# Altium project External_Board.PrjPcb
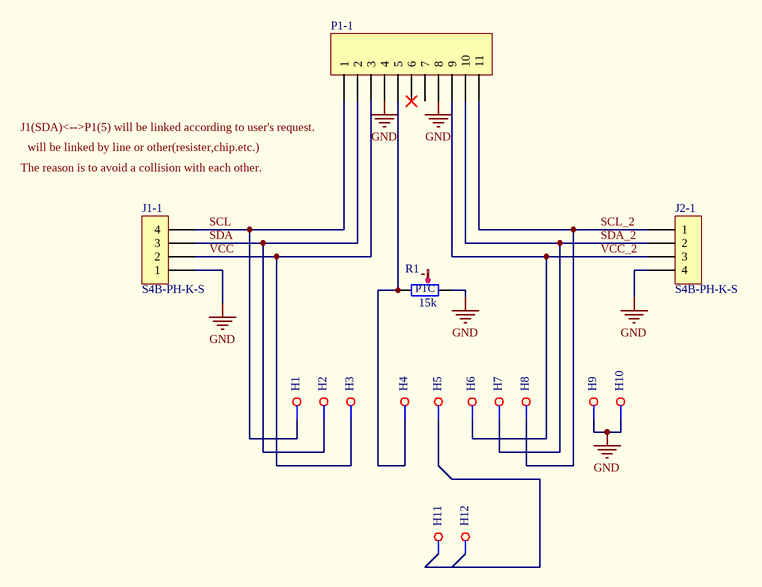
[diagram p0: External_Board_1mode.SchDoc]
3 sheets, 51 parts. Net scope: global (net labels, ports and power ports of the same name join across sheets).
Board files: External_Board_1 mode.PcbDoc, External_Board_2 mode.PcbDoc, External_Board_3 mode.PcbDoc
Sheets:
  External_Board_1mode.SchDoc
  External_Board_2mode.SchDoc
  External_Board_3mode.SchDoc

## Sheet External_Board_1mode.SchDoc: External Board Mode 1 - Resister Sense
size A4; DrawnBy: Anne Moller; Organization: Altium Limited; Address1: L3, 12a Rodborough Rd; Address2: Frenchs Forest; Address3: NSW; Address4: Australia 2086; Revision: 1.0.0; SheetNumber: 1; SheetTotal: 1

### Parts
(Parts that share a designator on the sheet are numbered #1, #2 ... from top to bottom, then left to right.)
H1#1  TP_HOLE  [TestHole]  (value not drawn)
H2#1  TP_HOLE  [TestHole]  (value not drawn)
H3#1  TP_HOLE  [TestHole]  (value not drawn)
H4#1  TP_HOLE  [TestHole]  (value not drawn)
H5#1  TP_HOLE  [TestHole]  (value not drawn)
H6#1  TP_HOLE  [TestHole]  (value not drawn)
H7#1  TP_HOLE  [TestHole]  (value not drawn)
H8#1  TP_HOLE  [TestHole]  (value not drawn)
H9#1  TP_HOLE  [TestHole]  (value not drawn)
H10#1  TP_HOLE  [TestHole]  (value not drawn)
H11#1  TP_HOLE  [TestHole]  (value not drawn)
H12#1  TP_HOLE  [TestHole]  (value not drawn)
J1-1  S4B-PH-K-S  [CON4]
J2-1  S4B-PH-K-S  [CON4]
P1-1  Header11  [CON11]  (value not drawn)
R1  Resistance in Ohms @ 25°C: 15k  [PTFT1206L1501JV]  (hidden comment: PTFT1206L1501JV)

### Nets
GND: H9#1.1(TP) H10#1.1(TP) J1-1.1 J2-1.4 P1-1.4 P1-1.8 R1.1
SCL: H1#1.1(TP) J1-1.4 P1-1.1
SCL_2: H8#1.1(TP) J2-1.1 P1-1.11
SDA: H2#1.1(TP) J1-1.3 P1-1.2
SDA_2: H7#1.1(TP) J2-1.2 P1-1.10
VCC: H3#1.1(TP) J1-1.2 P1-1.3
VCC_2: H6#1.1(TP) J2-1.3 P1-1.9
NetH4#1_1: H4#1.1(TP) P1-1.5 R1.2

Not connected (* = marked no-connect by the designer): H5#1 1(TP); H11#1 1(TP); H12#1 1(TP); P1-1 6* 7

### Notes on the sheet
- Labels drawn without touching a wire or pin: J1(SDA)<-->P1(5) will be linked according to user's request., The reason is to avoid a collision with each other., will be linked by line or other(resister,chip.etc.)
- Title
- Size:
- Date:
- A4
- Number:
- Time:
- Revision:
- Sheet
- of
- Drawn by:
- File:
- (in symbol PTFT1206L1501JV) PTC

### Library data of the parts
H1#1 H2#1 H3#1 H4#1 H5#1 H6#1 H7#1 H8#1 H9#1 H10#1 H11#1 H12#1 = TP_HOLE: TEST POINT HOLE
J1-1 J2-1 = S4B-PH-K-S (LF)(SN): JST (JAPAN SOLDERLESS TERMINALS) - S4B-PH-K-S (LF)(SN) - CONNECTOR, HEADER, 2MM, 4 POSITION, 1ROW; Supplier 1: Newark; Manufacturer: JST (JAPAN SOLDERLESS TERMINALS); Manufacturer Part Number: S4B-PH-K-S (LF)(SN); RoHS: YES; Stock 1: 908; Pricing 1: 1=0.14, 250=0.126, 500=0.112, 1000=0.101, 5000=0.069 (USD); ComponentLink1URL: http://www.farnell.com/datasheets/80564.pdf; ComponentLink1Description: http://www.farnell.com/datasheets/80564.pdf
P1-1 = SFH11-PBPC-D10-ST-BK: CONN HEADR FMALE 20POS .1" DL AU; Manufacturer: Sullins Connector Solutions; Connector Type: Header; Number of Positions: 20; Number of Positions Loaded: All; Pitch: 0.100" (2.54mm); Supplier 1: Digi-Key; Manufacturer Part Number: SFH11-PBPC-D10-ST-BK; RoHS: RoHS Compliant; Category: Connectors, Interconnects; Stock 1: 14457; Pricing 1: 1=1.43, 10=1.185, 25=1.0976, 50=0.9878, 100=0.878, 250=0.76824, 500=0.7024, 1000=0.63655, 2500=0.5707 (USD); Packaging: Tray; Contact Type: Female Socket; Number of Rows: 2; Row Spacing: 0.100" (2.54mm); Mounting Type: Through Hole; Termination: Solder; Fastening Type: -; Features: Polarizing Key; Contact Finish: Gold; Contact Finish Thickness: Flash; Color: Black; ComponentLink1URL: http://sullinscorp.com/catalogs/146_PAGE119_.100_SFH11_SERIES_FEMALE_HDR_ST_RA.pdf; ComponentLink1Description: http://sullinscorp.com/catalogs/146_PAGE119_.100_SFH11_SERIES_FEMALE_HDR_ST_RA.pdf
R1 = PTFT1206L1501JV: THERMISTOR PTC 1.5K OHM 5% 1206; Manufacturer: Vishay Dale; Power - Max: 125mW; Supplier 1: Digi-Key; Manufacturer Part Number: PTFT1206L1501JV; RoHS: RoHS Compliant; Category: Sensors, Transducers; Stock 1: 0; Pricing 1: 1000=0 (USD); Packaging: Tape & Reel (TR); Resistance Tolerance: ±5%; Operating Temperature: -55°C ~ 125°C; Mounting Type: Surface Mount; Package / Case: 1206 (3216 Metric); Supplier Device Package: 1206; ComponentLink1URL: http://media.digikey.com/pdf/Data%20Sheets/Vishay%20Dale%20PDFs/PTFT.pdf; ComponentLink1Description: http://media.digikey.com/pdf/Data%20Sheets/Vishay%20Dale%20PDFs/PTFT.pdf

## Sheet External_Board_2mode.SchDoc: External Board Mode 2 - 1 Wire
size A4; DrawnBy: Anne Moller; Organization: Altium Limited; Address1: L3, 12a Rodborough Rd; Address2: Frenchs Forest; Address3: NSW; Address4: Australia 2086; Revision: 1.0.0; SheetNumber: 1; SheetTotal: 1
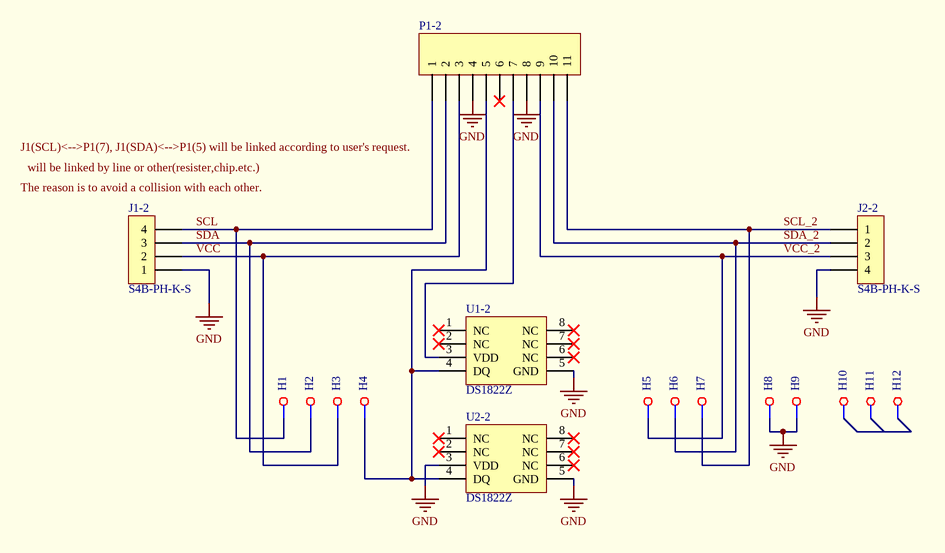
[diagram p1: External_Board_2mode.SchDoc]

### Parts
(Parts that share a designator on the sheet are numbered #1, #2 ... from top to bottom, then left to right.)
H1#2  TP_HOLE  [TestHole]  (value not drawn)
H2#2  TP_HOLE  [TestHole]  (value not drawn)
H3#2  TP_HOLE  [TestHole]  (value not drawn)
H4#2  TP_HOLE  [TestHole]  (value not drawn)
H5#2  TP_HOLE  [TestHole]  (value not drawn)
H6#2  TP_HOLE  [TestHole]  (value not drawn)
H7#2  TP_HOLE  [TestHole]  (value not drawn)
H8#2  TP_HOLE  [TestHole]  (value not drawn)
H9#2  TP_HOLE  [TestHole]  (value not drawn)
H10#2  TP_HOLE  [TestHole]  (value not drawn)
H11#2  TP_HOLE  [TestHole]  (value not drawn)
H12#2  TP_HOLE  [TestHole]  (value not drawn)
J1-2  S4B-PH-K-S  [CON4]
J2-2  S4B-PH-K-S  [CON4]
P1-2  Header11  [CON11]  (value not drawn)
U1-2  DS1822Z  [DS1822]
U2-2  DS1822Z  [DS1822]

### Nets
GND: H8#2.1(TP) H9#2.1(TP) J1-2.1 J2-2.4 P1-2.4 P1-2.8 U1-2.5(GND) U2-2.3(VDD) U2-2.5(GND)
SCL: H1#2.1(TP) J1-2.4 P1-2.1
SCL_2: H7#2.1(TP) J2-2.1 P1-2.11
SDA: H2#2.1(TP) J1-2.3 P1-2.2
SDA_2: H6#2.1(TP) J2-2.2 P1-2.10
VCC: H3#2.1(TP) J1-2.2 P1-2.3
VCC_2: H5#2.1(TP) J2-2.3 P1-2.9
NetH4#2_1: H4#2.1(TP) P1-2.5 U1-2.4(DQ) U2-2.4(DQ)
NetP1-2_7: P1-2.7 U1-2.3(VDD)

Not connected (* = marked no-connect by the designer): H10#2 1(TP); H11#2 1(TP); H12#2 1(TP); P1-2 6*; U1-2 1(NC)* 2(NC)* 6(NC)* 7(NC)* 8(NC)*; U2-2 1(NC)* 2(NC)* 6(NC)* 7(NC)* 8(NC)*

### Notes on the sheet
- Labels drawn without touching a wire or pin: J1(SCL)<-->P1(7), J1(SDA)<-->P1(5) will be linked according to user's request., The reason is to avoid a collision with each other., will be linked by line or other(resister,chip.etc.)
- Title
- Size:
- Date:
- A4
- Number:
- Time:
- Revision:
- Sheet
- of
- Drawn by:
- File:

### Library data of the parts
H1#2 H2#2 H3#2 H4#2 H5#2 H6#2 H7#2 H8#2 H9#2 H10#2 H11#2 H12#2 = TP_HOLE: TEST POINT HOLE
J1-2 J2-2 = S4B-PH-K-S (LF)(SN): as J1-1 on sheet External_Board_1mode; Supplier 1: Newark; Manufacturer: JST (JAPAN SOLDERLESS TERMINALS); Manufacturer Part Number: S4B-PH-K-S (LF)(SN); RoHS: YES; Stock 1: 908; Pricing 1: 1=0.14, 250=0.126, 500=0.112, 1000=0.101, 5000=0.069 (USD); ComponentLink1URL: http://www.farnell.com/datasheets/80564.pdf; ComponentLink1Description: http://www.farnell.com/datasheets/80564.pdf
P1-2 = SFH11-PBPC-D10-ST-BK: as P1-1 on sheet External_Board_1mode; Supplier 1: Digi-Key; Manufacturer Part Number: SFH11-PBPC-D10-ST-BK; RoHS: RoHS Compliant; Category: Connectors, Interconnects; Stock 1: 14457; Pricing 1: 1=1.43, 10=1.185, 25=1.0976, 50=0.9878, 100=0.878, 250=0.76824, 500=0.7024, 1000=0.63655, 2500=0.5707 (USD); Packaging: Tray; Contact Type: Female Socket; Number of Rows: 2; Row Spacing: 0.100" (2.54mm); Mounting Type: Through Hole; Termination: Solder; Fastening Type: -; Features: Polarizing Key; Contact Finish: Gold; Contact Finish Thickness: Flash; Color: Black; ComponentLink1URL: http://sullinscorp.com/catalogs/146_PAGE119_.100_SFH11_SERIES_FEMALE_HDR_ST_RA.pdf; ComponentLink1Description: http://sullinscorp.com/catalogs/146_PAGE119_.100_SFH11_SERIES_FEMALE_HDR_ST_RA.pdf
U1-2 U2-2 = DS1822Z+: SENSOR TEMPERATURE 1-WIRE 8SOIC; Manufacturer: Maxim Integrated; Sensor Type: Digital, Local; Sensing Temperature - Local: -55°C ~ 125°C; Output Type: 1-Wire®; Voltage - Supply: 3 V ~ 5.5 V; Resolution: 11 b; Accuracy - Highest (Lowest): ±2°C (±3°C); Test Condition: -10°C ~ 85°C (-55°C ~ 125°C); Supplier 1: Digi-Key; Manufacturer Part Number: DS1822Z+; RoHS: RoHS Compliant; Category: Sensors, Transducers; Stock 1: 1532; Pricing 1: 1=2.4, 10=2.321 (USD); Packaging: Tube; Sensing Temperature - Remote: -; Features: Output Switch, Programmable Limit, Standby Mode; Operating Temperature: -55°C ~ 125°C; Package / Case: 8-SOIC (0.154", 3.90mm Width); Supplier Device Package: 8-SOIC; ComponentLink1URL: http://datasheets.maximintegrated.com/en/ds/DS1822.pdf; ComponentLink1Description: http://datasheets.maximintegrated.com/en/ds/DS1822.pdf; Supplier 2: Digi-Key; Stock 2: 5995; Pricing 2: 1=2.14, 10=2.015, 25=1.6116, 50=1.531, 100=1.4102, 250=1.33764, 500=1.28928 (USD); ComponentLink2URL: http://datasheets.maximintegrated.com/en/ds/DS1775-DS1775R.pdf; ComponentLink2Description: http://datasheets.maximintegrated.com/en/ds/DS1775-DS1775R.pdf

## Sheet External_Board_3mode.SchDoc: External Board Mode 3 - I2C
size A4; DrawnBy: Anne Moller; Organization: Altium Limited; Address1: L3, 12a Rodborough Rd; Address2: Frenchs Forest; Address3: NSW; Address4: Australia 2086; Revision: 1.0.0; SheetNumber: 1; SheetTotal: 1
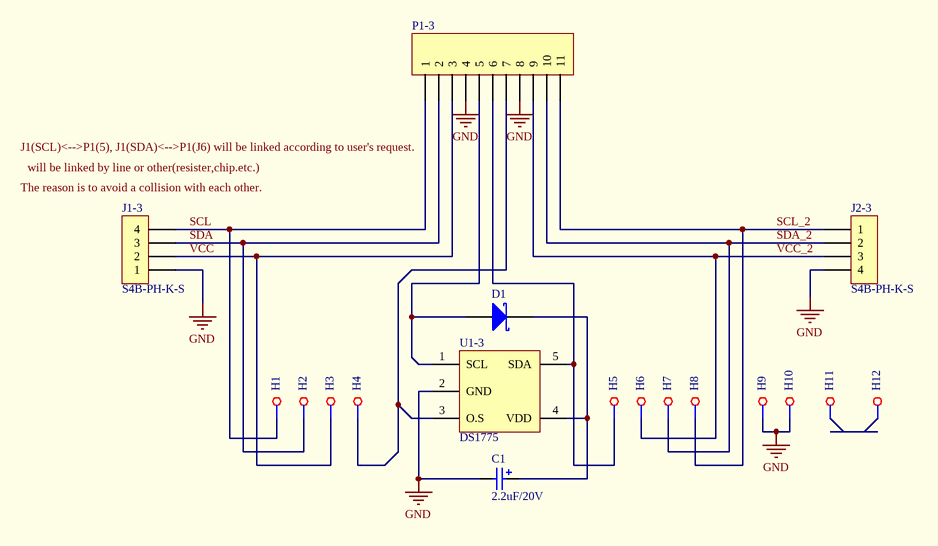
[diagram p2: External_Board_3mode.SchDoc]

### Parts
(Parts that share a designator on the sheet are numbered #1, #2 ... from top to bottom, then left to right.)
C1  2.2uF/20V  [C1206]
D1  MSS2P2-M3/89A  [MSS2P2-M3]  (value not drawn)
H1#3  TP_HOLE  [TestHole]  (value not drawn)
H2#3  TP_HOLE  [TestHole]  (value not drawn)
H3#3  TP_HOLE  [TestHole]  (value not drawn)
H4#3  TP_HOLE  [TestHole]  (value not drawn)
H5#3  TP_HOLE  [TestHole]  (value not drawn)
H6#3  TP_HOLE  [TestHole]  (value not drawn)
H7#3  TP_HOLE  [TestHole]  (value not drawn)
H8#3  TP_HOLE  [TestHole]  (value not drawn)
H9#3  TP_HOLE  [TestHole]  (value not drawn)
H10#3  TP_HOLE  [TestHole]  (value not drawn)
H11#3  TP_HOLE  [TestHole]  (value not drawn)
H12#3  TP_HOLE  [TestHole]  (value not drawn)
J1-3  S4B-PH-K-S  [CON4]
J2-3  S4B-PH-K-S  [CON4]
P1-3  Header11  [CON11]  (value not drawn)
U1-3  DS1775  [DS1775]

### Nets
GND: C1.2 H9#3.1(TP) H10#3.1(TP) J1-3.1 J2-3.4 P1-3.4 P1-3.8 U1-3.2(GND)
SCL: H1#3.1(TP) J1-3.4 P1-3.1
SCL_2: H8#3.1(TP) J2-3.1 P1-3.11
SDA: H2#3.1(TP) J1-3.3 P1-3.2
SDA_2: H7#3.1(TP) J2-3.2 P1-3.10
VCC: H3#3.1(TP) J1-3.2 P1-3.3
VCC_2: H6#3.1(TP) J2-3.3 P1-3.9
NetC1_1: C1.1 D1.2(K) U1-3.4(VDD)
NetD1_1: D1.1(A) P1-3.5 U1-3.1(SCL)
NetH4#3_1: H4#3.1(TP) P1-3.7 U1-3.3(O.S)
NetH5#3_1: H5#3.1(TP) P1-3.6 U1-3.5(SDA)

Not connected (* = marked no-connect by the designer): H11#3 1(TP); H12#3 1(TP)

### Notes on the sheet
- Labels drawn without touching a wire or pin: J1(SCL)<-->P1(5), J1(SDA)<-->P1(J6) will be linked according to user's request., The reason is to avoid a collision with each other., will be linked by line or other(resister,chip.etc.)
- Title
- Size:
- Date:
- A4
- Number:
- Time:
- Revision:
- Sheet
- of
- Drawn by:
- File:

### Library data of the parts
C1 = TAJA225K020RNJ: CAP TANT 2.2UF 20V 10% 1206; Manufacturer: AVX Corporation; Manufacturer Size Code: A; Capacitance: 2.2µF; ESR (Equivalent Series Resistance): 5.3 Ohm; Type: Molded; Supplier 1: Digi-Key; Manufacturer Part Number: TAJA225K020RNJ; RoHS: RoHS Compliant; Category: Capacitors; Stock 1: 864; Pricing 1: 1=0.35, 10=0.295, 100=0.1476, 250=0.11072, 500=0.09778, 1000=0.08672 (USD); Packaging: Digi-Reel®; Tolerance: ±10%; Voltage - Rated: 20V; Operating Temperature: -55°C ~ 125°C; Mounting Type: Surface Mount; Package / Case: 1206 (3216 Metric); Size / Dimension: 0.126" L x 0.063" W (3.20mm x 1.60mm); Height - Seated (Max): 0.071" (1.80mm); Lead Spacing: -; Features: General Purpose; Lifetime @ Temp.: -; ComponentLink1URL: http://datasheets.avx.com/TAJ.pdf; ComponentLink1Description: http://datasheets.avx.com/TAJ.pdf
D1 = MSS2P2-M3/89A: DIODE SCHOTTKY 20V 2A MICROSMP; Manufacturer: Vishay Semiconductor Diodes Division; Voltage - Forward (Vf) (Max) @ If: 600mV @ 2A; Speed: Fast Recovery =< 500ns, > 200mA (Io); Current - Reverse Leakage @ Vr: 250µA @ 20V; Capacitance @ Vr, F: 65pF @ 4V, 1MHz; Supplier 1: Digi-Key; Manufacturer Part Number: MSS2P2-M3/89A; RoHS: RoHS Compliant; Category: Discrete Semiconductor Products; Stock 1: 16161; Pricing 1: 1=0.37, 10=0.274, 100=0.1552, 500=0.1029, 1000=0.07892 (USD); Packaging: Cut Tape (CT); Diode Type: Schottky; Voltage - DC Reverse (Vr) (Max): 20V; Current - Average Rectified (Io): 2A; Reverse Recovery Time (trr): -; Mounting Type: Surface Mount; Package / Case: MicroSMP; Supplier Device Package: MicroSMP; Operating Temperature - Junction: -55°C ~ 150°C; ComponentLink1URL: http://www.vishay.com/docs/89054/mss2p3.pdf; ComponentLink1Description: http://www.vishay.com/docs/89054/mss2p3.pdf
H1#3 H2#3 H3#3 H4#3 H5#3 H6#3 H7#3 H8#3 H9#3 H10#3 H11#3 H12#3 = TP_HOLE: TEST POINT HOLE
J1-3 J2-3 = S4B-PH-K-S (LF)(SN): as J1-1 on sheet External_Board_1mode; Supplier 1: Newark; Manufacturer: JST (JAPAN SOLDERLESS TERMINALS); Manufacturer Part Number: S4B-PH-K-S (LF)(SN); RoHS: YES; Stock 1: 908; Pricing 1: 1=0.14, 250=0.126, 500=0.112, 1000=0.101, 5000=0.069 (USD); ComponentLink1URL: http://www.farnell.com/datasheets/80564.pdf; ComponentLink1Description: http://www.farnell.com/datasheets/80564.pdf
P1-3 = SFH11-PBPC-D10-ST-BK: as P1-1 on sheet External_Board_1mode; Supplier 1: Digi-Key; Manufacturer Part Number: SFH11-PBPC-D10-ST-BK; RoHS: RoHS Compliant; Category: Connectors, Interconnects; Stock 1: 14457; Pricing 1: 1=1.43, 10=1.185, 25=1.0976, 50=0.9878, 100=0.878, 250=0.76824, 500=0.7024, 1000=0.63655, 2500=0.5707 (USD); Packaging: Tray; Contact Type: Female Socket; Number of Rows: 2; Row Spacing: 0.100" (2.54mm); Mounting Type: Through Hole; Termination: Solder; Fastening Type: -; Features: Polarizing Key; Contact Finish: Gold; Contact Finish Thickness: Flash; Color: Black; ComponentLink1URL: http://sullinscorp.com/catalogs/146_PAGE119_.100_SFH11_SERIES_FEMALE_HDR_ST_RA.pdf; ComponentLink1Description: http://sullinscorp.com/catalogs/146_PAGE119_.100_SFH11_SERIES_FEMALE_HDR_ST_RA.pdf
U1-3 = DS1775R4+T&R: SENSOR TEMPERATURE I2C SOT23-5; Manufacturer: Maxim Integrated; Sensor Type: Digital, Local; Sensing Temperature - Local: -55°C ~ 125°C; Output Type: I²C; Voltage - Supply: 2.7 V ~ 5.5 V; Resolution: 11 b; Accuracy - Highest (Lowest): ±2°C (±3°C); Test Condition: 10°C ~ 85°C (-55°C ~ 125°C); Supplier 1: Digi-Key; Manufacturer Part Number: DS1775R4+T&R; RoHS: RoHS Compliant; Category: Sensors, Transducers; Stock 1: 5995; Pricing 1: 1=2.14, 10=2.015, 25=1.6116, 50=1.531, 100=1.4102, 250=1.33764, 500=1.28928 (USD); Packaging: Cut Tape (CT); Sensing Temperature - Remote: -; Features: Output Switch, Programmable Limit, Programmable Resolution, Shutdown Mode; Operating Temperature: -55°C ~ 125°C; Package / Case: SC-74A, SOT-753; Supplier Device Package: SOT-23-5; ComponentLink1URL: http://datasheets.maximintegrated.com/en/ds/DS1775-DS1775R.pdf; ComponentLink1Description: http://datasheets.maximintegrated.com/en/ds/DS1775-DS1775R.pdf

## Nets that join several sheets
GND: External_Board_1mode (7 pins), External_Board_2mode (9 pins), External_Board_3mode (8 pins)
SCL: External_Board_1mode (H1#1.1 J1-1.4 P1-1.1), External_Board_2mode (H1#2.1 J1-2.4 P1-2.1), External_Board_3mode (H1#3.1 J1-3.4 P1-3.1)
SCL_2: External_Board_1mode (H8#1.1 J2-1.1 P1-1.11), External_Board_2mode (H7#2.1 J2-2.1 P1-2.11), External_Board_3mode (H8#3.1 J2-3.1 P1-3.11)
SDA: External_Board_1mode (H2#1.1 J1-1.3 P1-1.2), External_Board_2mode (H2#2.1 J1-2.3 P1-2.2), External_Board_3mode (H2#3.1 J1-3.3 P1-3.2)
SDA_2: External_Board_1mode (H7#1.1 J2-1.2 P1-1.10), External_Board_2mode (H6#2.1 J2-2.2 P1-2.10), External_Board_3mode (H7#3.1 J2-3.2 P1-3.10)
VCC: External_Board_1mode (H3#1.1 J1-1.2 P1-1.3), External_Board_2mode (H3#2.1 J1-2.2 P1-2.3), External_Board_3mode (H3#3.1 J1-3.2 P1-3.3)
VCC_2: External_Board_1mode (H6#1.1 J2-1.3 P1-1.9), External_Board_2mode (H5#2.1 J2-2.3 P1-2.9), External_Board_3mode (H6#3.1 J2-3.3 P1-3.9)